# Altium schematic sheet 03-GPS_DaughterCards.SchDoc
size A; DocumentNumber: 3; SheetNumber: 3; SheetTotal: 4
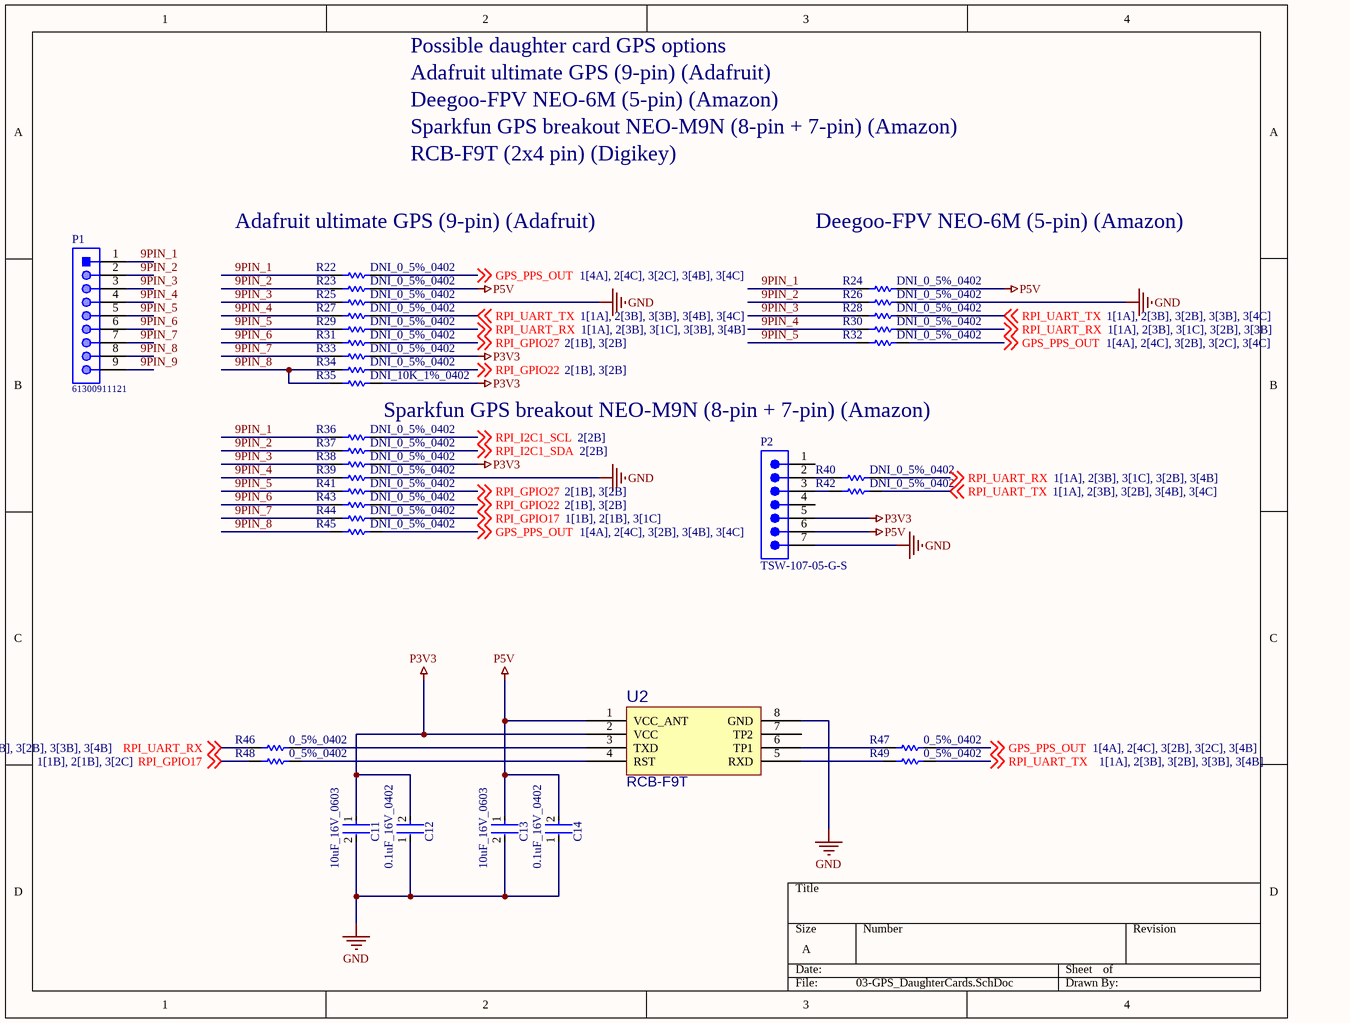
[diagram p0: 03-GPS_DaughterCards.SchDoc]

## Parts
C11  10uF_16V_0603  [FP-0603-L_1_6_0_2-W_0_8_0-MFG]
C12  0.1uF_16V_0402  [FP-GRM15-MFG]
C13  10uF_16V_0603  [FP-0603-L_1_6_0_2-W_0_8_0-MFG]
C14  0.1uF_16V_0402  [FP-GRM15-MFG]
P1  61300911121  [61300911121]  (no BOM)
P2  TSW-107-05-G-S  [SMTC-TSW-107-05-X-S]  (no BOM)
R22  DNI_0_5%_0402  [RESC1005X40X25NL05T10]  (no BOM)
R23  DNI_0_5%_0402  [RESC1005X40X25NL05T10]  (no BOM)
R24  DNI_0_5%_0402  [RESC1005X40X25NL05T10]  (no BOM)
R25  DNI_0_5%_0402  [RESC1005X40X25NL05T10]  (no BOM)
R26  DNI_0_5%_0402  [RESC1005X40X25NL05T10]  (no BOM)
R27  DNI_0_5%_0402  [RESC1005X40X25NL05T10]  (no BOM)
R28  DNI_0_5%_0402  [RESC1005X40X25NL05T10]  (no BOM)
R29  DNI_0_5%_0402  [RESC1005X40X25NL05T10]  (no BOM)
R30  DNI_0_5%_0402  [RESC1005X40X25NL05T10]  (no BOM)
R31  DNI_0_5%_0402  [RESC1005X40X25NL05T10]  (no BOM)
R32  DNI_0_5%_0402  [RESC1005X40X25NL05T10]  (no BOM)
R33  DNI_0_5%_0402  [RESC1005X40X25NL05T10]  (no BOM)
R34  DNI_0_5%_0402  [RESC1005X40X25NL05T10]  (no BOM)
R35  DNI_10K_1%_0402  [RESC1005X40X25LL05T05]  (no BOM)
R36  DNI_0_5%_0402  [RESC1005X40X25NL05T10]  (no BOM)
R37  DNI_0_5%_0402  [RESC1005X40X25NL05T10]  (no BOM)
R38  DNI_0_5%_0402  [RESC1005X40X25NL05T10]  (no BOM)
R39  DNI_0_5%_0402  [RESC1005X40X25NL05T10]  (no BOM)
R40  DNI_0_5%_0402  [RESC1005X40X25NL05T10]  (no BOM)
R41  DNI_0_5%_0402  [RESC1005X40X25NL05T10]  (no BOM)
R42  DNI_0_5%_0402  [RESC1005X40X25NL05T10]  (no BOM)
R43  DNI_0_5%_0402  [RESC1005X40X25NL05T10]  (no BOM)
R44  DNI_0_5%_0402  [RESC1005X40X25NL05T10]  (no BOM)
R45  DNI_0_5%_0402  [RESC1005X40X25NL05T10]  (no BOM)
R46  0_5%_0402  [RESC1005X40X25NL05T10]
R47  0_5%_0402  [RESC1005X40X25NL05T10]
R48  0_5%_0402  [RESC1005X40X25NL05T10]
R49  0_5%_0402  [RESC1005X40X25NL05T10]
U2  RCB-F9T  [GNSS]  (no BOM)

## Nets
GND: C11.2 C12.1 C13.2 C14.1 P2.7 R25.2 R26.2 R39.2 U2.8(GND)
P3V3: C11.1 C12.2 P2.5 R33.2 R35.2 R38.2 U2.2(VCC)
P5V: C13.1 C14.2 P2.6 R23.2 R24.2 U2.1(VCC_ANT)
9PIN_1: P1.1 R22.1 R24.1 R36.1
9PIN_2: P1.2 R23.1 R26.1 R37.1
9PIN_3: P1.3 R25.1 R28.1 R38.1
9PIN_4: P1.4 R27.1 R30.1 R39.1
9PIN_5: P1.5 R29.1 R32.1 R41.1
9PIN_6: P1.6 R31.1 R43.1
9PIN_7: P1.7 R33.1 R44.1
9PIN_8: P1.8 R34.1 R35.1 R45.1
9PIN_9: P1.9
GPS_PPS_OUT: R22.2 R32.2 R45.2 R47.2 ; off-sheet GPS_PPS_OUT
RPI_GPIO17: R44.2 R48.1 ; off-sheet RPI_GPIO17
RPI_GPIO22: R34.2 R43.2 ; off-sheet RPI_GPIO22
RPI_GPIO27: R31.2 R41.2 ; off-sheet RPI_GPIO27
RPI_I2C1_SCL: R36.2 ; off-sheet RPI_I2C1_SCL
RPI_I2C1_SDA: R37.2 ; off-sheet RPI_I2C1_SDA
RPI_UART_RX: R29.2 R30.2 R40.2 R46.1 ; off-sheet RPI_UART_RX
RPI_UART_TX: R27.2 R28.2 R42.2 R49.2 ; off-sheet RPI_UART_TX
NetP2_2: P2.2 R40.1
NetP2_3: P2.3 R42.1
NetR46_2: R46.2 U2.3(TXD)
NetR47_1: R47.1 U2.6(TP1)
NetR48_2: R48.2 U2.4(RST)
NetR49_1: R49.1 U2.5(RXD)

Not connected (* = marked no-connect by the designer): P2 1 4; U2 7(TP2)

## Notes on the sheet
- Possible daughter card GPS options
- Adafruit ultimate GPS (9-pin) (Adafruit)
- Deegoo-FPV NEO-6M (5-pin) (Amazon)
- Sparkfun GPS breakout NEO-M9N (8-pin + 7-pin) (Amazon)
- RCB-F9T (2x4 pin) (Digikey)

## Library data of the parts
C11 C13 = CMP-2000-06226-4: Multilayer Ceramic Capacitor 10uF 16V X5R 20% SMD 0603 T/R; Packaging: Tape and Reel; Construction: Flat; Height: 0.8mm; Max Operating Temperature: 85°C; Dielectric: X5R; Case Code (Metric): 1608; Voltage Rating (DC): 16V; Width: 0.031inch; Voltage Rating: 16V; Length: 0.063inch; RoHS Compliant: Yes; Halogen Free: Halogen Free; Case Code (Imperial): 0603; Capacitance: 10uF; Mount: Surface Mount; Thickness: 0.031inch; Tolerance: 20%; Min Operating Temperature: -55°C; Series: M; Termination: SMD/SMT; Case/Package: 0603; Package Quantity: 1
C12 C14 = CMP-2100-03641-2: CAP CER 0.1UF 16V X7R 0402; Manufacturer Part Number: GRM155R71C104KA88D; Manufacturer: Murata; Standoff Height: 0mm; Tolerance: 10%; Voltage Rating: 16Vdc; Material: Ceramic; Capacitance: 0.10μF; Value: 0.10μF; RoHS: TRUE; Temperature Characteristic: X7R; Octopart: https://octopart.com/grm155r71c104ka88d-murata-196880; Digikey Description: CAP CER 0.1UF 16V X7R 0402; Device Class L3: Ceramic Capacitors; Height: 0.55mm; ComponentLink2Description: Datasheet; Temperature Range Low: -55°C; Ipc Land Pattern Name: CAPC10050X219; ComponentLink2URL: https://search.murata.co.jp/Ceramy/image/img/A01X/G101/ENG/GRM155R71H471KA01-01A.pdf; Device Class L1: Passive Components; Lead Free: yes; Category: Cap; Package: GRM15; Temperature: -55°C to +125°C; Device Class L2: Capacitors; Temperature Range High: +125°C; Mouser Description: 0402 0.1 uF 16V ±10 % Tolerance X7R SMT Multilayer Ceramic Capacitor
P1 = CMP-1502-01080-1: THT Vertical Pin Header WR-PHD, Pitch 2.54 mm, Single Row, 9 pins; Manufacturer: Wurth Elektronik; Pitch: 2.54mm; Gender: Male; Working Voltage: 250VAC; Contact Resistance: 20mOhm; Withstanding Voltage: 500VAC; Pin Number: 9; Rated Current: 3A; Package Reference: 61300911121; Part Number: 61300911121; Mounting Technology: THT; Publisher: WurthElektronik; Manufacturer URL: http://www.we-online.de; Orientation: Vertical; Datasheet URL: https://katalog.we-online.de/em/datasheet/6130xx11121.pdf; Operating Temperature: -40to105degC; Row Number: Single; Packaging: Bag
P2 = CMP-1024-00400-1: 0.025" SQ Post Header, Through-hole, Vertical, -55 to 125 degC, 2.54 mm Pitch, 7-Pin, Male, RoHS; Manufacturer: Samtec; Pitch: 2.54 mm; PackageReference: TSW-107-05-X-S; Orientation: Vertical; ComponentLink2Description: Datasheet; Mounting Technology: Through-hole; PackageDescription: .025[0.64] SQ. Post Terminal Strip Assembly; PackageVersion: DM, 8/1988; RoHS: True; ComponentLink1Description: Manufacturer URL; ComponentLink2URL: http://www.samtec.com/documents/webfiles/pdf/TSW_TH.PDF; PartNumber: TSW-107-05-G-S; DatasheetVersion: F-214; ComponentLink3URL: http://www.samtec.com/documents/webfiles/cpdf/TSW-XXX-XX-XXX-X-XX-XXX-MKT.pdf; ComponentLink1URL: http://www.samtec.com; ComponentLink3Description: Package Specification; Temperature Range: -55 to 125 degC
R22-R34 R36-R49 = CMP-1011-00001-2: Manufacturer: Yageo / Phycomp; Part Number: RC0402JR-070RL
R35 = CMP-2000-07588-1: Chip Resistor, 10 KOhm, +/- 1%, 0.1 W, -55 to 155 degC, 0402 (1005 Metric), RoHS, Tape and Reel; Manufacturer: Panasonic; Power Rating: 100mW; Voltage Rating: 50V; Resistance: 10KOhm; Case\/Package: 0402; Temperature Coefficient: 100ppm\/degreesC; RoHSCompliant: True; Lead Free: LeadFree; Package Quantity: 1; Contact Plating: Tin; Length: 1mm; Radiation Hardening: No; REACH SVHC: NoSVHC; Max Operating Temperature: 155degC; Depth: 0.5mm; Case Code (Imperial): 0402; Military Standard: Not; Package Description: 2-Pin Surface Mount Device, Body 1 x 0.5 mm; Termination: SMD/SMT; Case Code (Metric): 1005; Height: 0.35mm; Packaging: TapeandReel; Voltage Rating (DC): 50V; Package Reference: 402; Number of Pins: 2; Tolerance: 1%; Mounting Technology: SurfaceMount; Width: 0.02inch; Mount: SurfaceMount; Datasheet URL: https://industrial.panasonic.com/cdbs/www-data/pdf/RDA0000/AOA0000C304.pdf; Composition: ThickFilm; Datasheet Version: 02/2017; Manufacturer URL: http://www.panasonic.com/; Max Power Dissipation: 100mW; Number of Terminations: 2; Min Operating Temperature: -55degC
U2 = RCB-F9T: MOD, GPS; VELENTIUM PART NUM: <V PART NUM>; MFG NAME: UBLOCKS; MINTEMP: -40C; MAXTEMP: 80C; DESC: MOD BLE 4.2; MFG PART NUM: RCB-F9T; CATEGORY: MOD; MODIFY DATE: 9/11/13; P1: GPS; SHEETPART: *; DATE: .; Supplier 1: Digi-Key; Supplier Part Number 1: 672-RCB-F9T-ND